# EAGLE design pendant2 (EAGLE 7.1.0)
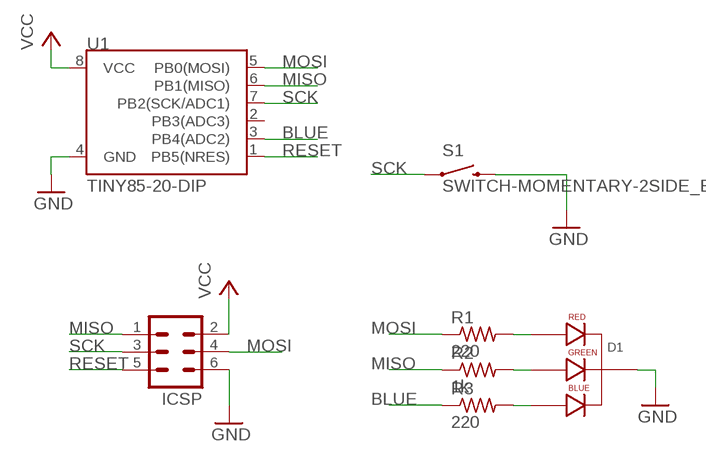
[diagram p0: schematic, sheet 1]

## Parts
D1  LED-RGB-CC-THRUCLEAR  [LED-RGB-THRU]
ICSP  MA03-2  [MA03-2]
R1  220  R-US_0207/2V  [0207/2V]
R2  1k  R-US_0207/2V  [0207/2V]
R3  220  R-US_0207/2V  [0207/2V]
S1  SWITCH-MOMENTARY-2SIDE_EZ  [TACTILE-PTH-SIDEEZ]
U1  TINY85-20-DIP  ATTINY45TINY85-20-DIP  [DIP08]

## Nets
BLUE: R3.1 U1.3(PB4(ADC2))
GND: D1.2(CATHODE) ICSP.6 S1.2 U1.4(GND)
MISO: ICSP.1 R2.1 U1.6(PB1(MISO))
MOSI: ICSP.4 R1.1 U1.5(PB0(MOSI))
N$1: D1.1(RED_CATHODE) R1.2
N$2: D1.3(GREEN_CATHODE) R2.2
N$3: D1.4(BLUE_CATHODE) R3.2
RESET: ICSP.5 U1.1(PB5(NRES))
SCK: ICSP.3 S1.1 U1.7(PB2(SCK/ADC1))
VCC: ICSP.2 U1.8(VCC)
Unconnected: U1.2(PB3(ADC3))

## Library data of the parts
D1 = SparkFun-LED:LED-RGB-CC-THRU: RGB Through-hole common cathode LED SparkFun Storefront: COM-00105 (Clear) COM-09264 (Diffuse); PROD_ID: DIO-08418
ICSP = con-lstb:MA03-2: PIN HEADER; OC_FARNELL: unknown; OC_NEWARK: unknown
R1-R3 = resistor:R-US_: RESISTOR, American symbol
S1 = SparkFun-Electromechanical:SWITCH-MOMENTARY-2: Various NO switches- pushbuttons, reed, etc
U1 = SparkFun-DigitalIC:ATTINY45: Atmel 8-pin 2/4/8kB flash uC; PROD_ID: IC-09445

## Board
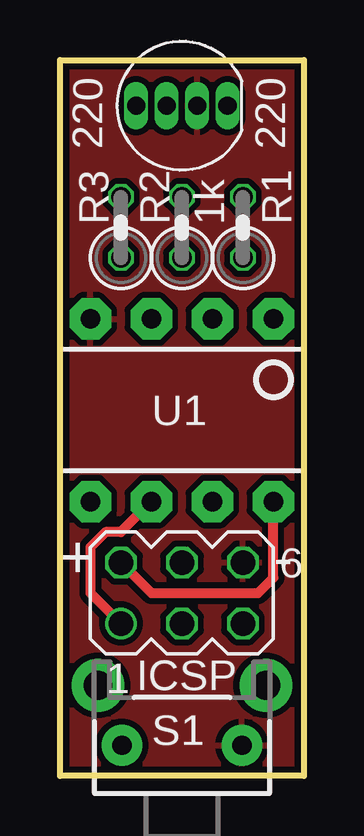
[diagram p1: board, top side]
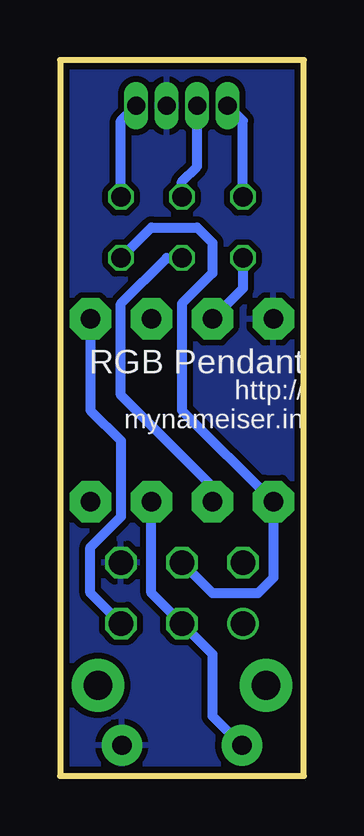
[diagram p2: board, bottom side, seen from below]

Size 10.16 x 29.84 mm. Coordinates in mm from the lower left corner, seen from the top.
Outline: 0,0 0,29.84 10.16,29.84 10.16,0 0,0
Copper layers (1*16): Top 0.035mm / dielectric 1.5mm / Bottom 0.035mm
Design rules "SparkFun *": minimum track width 8mil, minimum drill 20mil, track to track 8mil, track to pad 8mil, pad to pad 8mil, via to via 8mil, smd to smd 8mil, copper to edge 8mil, drill to drill 8mil, minimum pad ring 0mil, minimum via ring 10mil, stop-mask expansion 4mil, vias tented up to drill 20mil, thermal gap 10mil

### Footprints (pad centres in the part's own frame; a part is rotated, then mirrored left to right if it is on the bottom)
LED-RGB-THRU = drill 0.762 pad 0.889 long: 1 1.905,0; 2 0.635,0; 3 -0.635,0; 4 -1.905,0
MA03-2 = drill 1.016: 1 -2.54,-1.27 | drill 1.016 octagon: 2 -2.54,1.27; 3 0,-1.27; 4 0,1.27; 5 2.54,-1.27; 6 2.54,1.27
0207/2V = drill 0.813 octagon: 1 -1.27,0; 2 1.27,0
TACTILE-PTH-SIDEEZ = drill 0.8 pad 1.7: 1 -2.5,0; 2 2.5,0 | drill 1.2 pad 2.2: ANCHOR1 -3.5,2.5; ANCHOR2 3.5,2.5
DIP08 = drill 0.813 pad 1.727 octagon: 1 -3.81,-3.81; 2 -1.27,-3.81; 3 1.27,-3.81; 4 3.81,-3.81; 5 3.81,3.81; 6 1.27,3.81; 7 -1.27,3.81; 8 -3.81,3.81

### Placement (x,y rotation side)
D1  5.08,27.94 0 top
ICSP  5.08,7.62 0 top
R1  7.62,22.86 90 top
R2  5.08,22.86 90 top
R3  2.54,22.86 90 top
S1  5.08,1.27 0 top
U1  5.08,15.24 180 top

### Tracks (layer width: path | path; a pad name or v marks a point on that pad's centre or on a via)
BLUE
  Bottom 0.406: R3.1 2.54,20.32 U1.3
GND
  pour Bottom (isolate 0.254): 0,29.84 10.16,29.84 10.16,0 0,0
  pour Top (isolate 0.254): 0,29.84 10.16,29.84 10.16,0 0,0
MISO
  Top 0.406: U1.6 2.54,10.16 1.91,10.16 1.27,9.53 1.27,7.62 ICSP.1
  Bottom 0.406: U1.6 3.81,12.06 7.62,15.87 7.62,19.69 5.71,21.59 R2.1
MOSI
  Bottom 0.406: R1.1 6.35,22.86 4.45,22.86 3.81,22.23 3.81,20.95 5.08,19.69 5.08,15.24 U1.5 1.27,8.26 1.91,7.62 3.81,7.62 ICSP.4
N$1
  Bottom 0.406: R1.2 7.62,27.3 D1.1
N$2
  Bottom 0.406: R2.2 5.08,24.77 4.45,25.4 D1.3
N$3
  Bottom 0.406: R3.2 2.54,27.3 D1.4
RESET
  Bottom 0.406: ICSP.5 8.89,7.62 8.89,9.53 7.62,10.79 7.62,13.97 8.89,15.24 U1.1
SCK
  Bottom 0.406: U1.7 6.35,7.62 ICSP.3 3.81,5.08 3.81,2.5 S1.1
VCC
  Top 0.406: ICSP.2 3.81,7.62 8.26,7.62 8.89,8.26 U1.8

### Text on the board
tPlace: + | -
bPlace: RGB Pendant | http:// / mynameiser.in